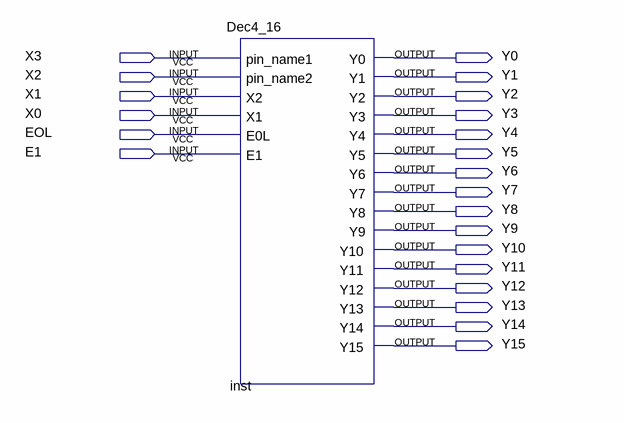
[diagram p0: schematic sheet]
// Quartus schematic DecoderDemo2.bdf as structural Verilog: 1 symbols, 22 pins
module DecoderDemo2 (
  input  X3,
  input  X2,
  input  X1,
  input  X0,
  input  EOL,
  input  E1,
  output Y0,
  output Y1,
  output Y2,
  output Y3,
  output Y4,
  output Y5,
  output Y6,
  output Y7,
  output Y8,
  output Y9,
  output Y10,
  output Y11,
  output Y12,
  output Y13,
  output Y14,
  output Y15
);

  Dec4_16 inst (
    .pin_name1(X3), .pin_name2(X2), .X2(X1), .X1(X0), .E0L(EOL), .E1(E1), .Y0(Y0), .Y1(Y1), .Y2(Y2), .Y3(Y3),
    .Y4(Y4), .Y5(Y5), .Y6(Y6), .Y7(Y7), .Y8(Y8), .Y9(Y9), .Y10(Y10), .Y11(Y11), .Y12(Y12), .Y13(Y13),
    .Y14(Y14), .Y15(Y15));
endmodule
